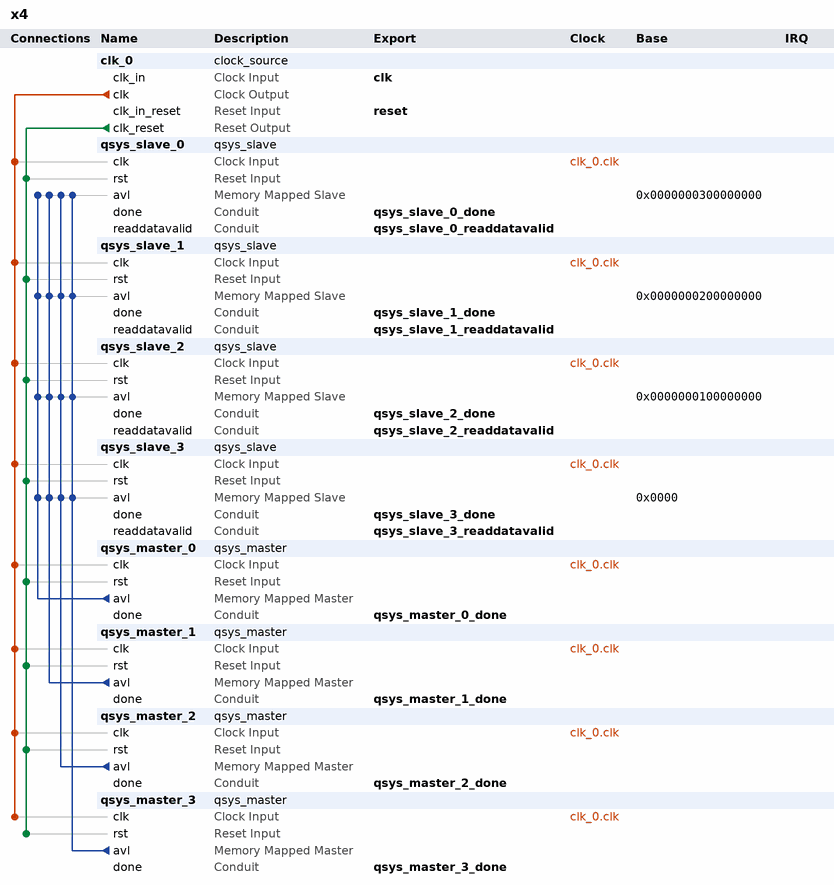
[diagram p0: system contents]
# Platform Designer (Qsys) system x4, Stratix V 5SGSED8K1F40C2
# Parameters at their usual value, and those the tool derives, are not listed.
package require -exact qsys 14.0
create_system x4
set_project_property DEVICE_FAMILY {Stratix V}
set_project_property DEVICE 5SGSED8K1F40C2

add_instance clk_0 clock_source 14.0
set_instance_parameter_value clk_0 clockFrequency 100000000

add_instance qsys_slave_0 qsys_slave 1.0
set_instance_parameter_value qsys_slave_0 WIDTH 32
set_instance_parameter_value qsys_slave_0 SRC_ID 0
set_instance_parameter_value qsys_slave_0 SNK_ID 1
set_instance_parameter_value qsys_slave_0 ADDR_WIDTH 30

add_instance qsys_slave_1 qsys_slave 1.0
set_instance_parameter_value qsys_slave_1 WIDTH 32
set_instance_parameter_value qsys_slave_1 SRC_ID 10
set_instance_parameter_value qsys_slave_1 SNK_ID 11
set_instance_parameter_value qsys_slave_1 ADDR_WIDTH 30

add_instance qsys_slave_2 qsys_slave 1.0
set_instance_parameter_value qsys_slave_2 WIDTH 32
set_instance_parameter_value qsys_slave_2 SRC_ID 12
set_instance_parameter_value qsys_slave_2 SNK_ID 13
set_instance_parameter_value qsys_slave_2 ADDR_WIDTH 30

add_instance qsys_slave_3 qsys_slave 1.0
set_instance_parameter_value qsys_slave_3 WIDTH 32
set_instance_parameter_value qsys_slave_3 SRC_ID 14
set_instance_parameter_value qsys_slave_3 SNK_ID 15
set_instance_parameter_value qsys_slave_3 ADDR_WIDTH 30

add_instance qsys_master_0 qsys_master 1.0
set_instance_parameter_value qsys_master_0 WIDTH 32
set_instance_parameter_value qsys_master_0 SRC_ID 2
set_instance_parameter_value qsys_master_0 SNK_ID 3
set_instance_parameter_value qsys_master_0 DST_ID 0
set_instance_parameter_value qsys_master_0 NUM_SLAVES 4
set_instance_parameter_value qsys_master_0 ADDR_WIDTH 34

add_instance qsys_master_1 qsys_master 1.0
set_instance_parameter_value qsys_master_1 WIDTH 32
set_instance_parameter_value qsys_master_1 SRC_ID 4
set_instance_parameter_value qsys_master_1 SNK_ID 5
set_instance_parameter_value qsys_master_1 DST_ID 0
set_instance_parameter_value qsys_master_1 NUM_SLAVES 4
set_instance_parameter_value qsys_master_1 ADDR_WIDTH 34

add_instance qsys_master_2 qsys_master 1.0
set_instance_parameter_value qsys_master_2 WIDTH 32
set_instance_parameter_value qsys_master_2 SRC_ID 6
set_instance_parameter_value qsys_master_2 SNK_ID 7
set_instance_parameter_value qsys_master_2 DST_ID 0
set_instance_parameter_value qsys_master_2 NUM_SLAVES 4
set_instance_parameter_value qsys_master_2 ADDR_WIDTH 34

add_instance qsys_master_3 qsys_master 1.0
set_instance_parameter_value qsys_master_3 WIDTH 32
set_instance_parameter_value qsys_master_3 SRC_ID 8
set_instance_parameter_value qsys_master_3 SNK_ID 9
set_instance_parameter_value qsys_master_3 DST_ID 0
set_instance_parameter_value qsys_master_3 NUM_SLAVES 4
set_instance_parameter_value qsys_master_3 ADDR_WIDTH 34

# connections
add_connection clk_0.clk qsys_master_0.clk clock
add_connection clk_0.clk qsys_master_1.clk clock
add_connection clk_0.clk qsys_master_2.clk clock
add_connection clk_0.clk qsys_master_3.clk clock
add_connection clk_0.clk qsys_slave_0.clk clock
add_connection clk_0.clk qsys_slave_1.clk clock
add_connection clk_0.clk qsys_slave_2.clk clock
add_connection clk_0.clk qsys_slave_3.clk clock
add_connection clk_0.clk_reset qsys_master_0.rst reset
add_connection clk_0.clk_reset qsys_master_1.rst reset
add_connection clk_0.clk_reset qsys_master_2.rst reset
add_connection clk_0.clk_reset qsys_master_3.rst reset
add_connection clk_0.clk_reset qsys_slave_0.rst reset
add_connection clk_0.clk_reset qsys_slave_1.rst reset
add_connection clk_0.clk_reset qsys_slave_2.rst reset
add_connection clk_0.clk_reset qsys_slave_3.rst reset
add_connection qsys_master_0.avl qsys_slave_0.avl avalon
set_connection_parameter_value qsys_master_0.avl/qsys_slave_0.avl baseAddress 0x0000000300000000
add_connection qsys_master_0.avl qsys_slave_1.avl avalon
set_connection_parameter_value qsys_master_0.avl/qsys_slave_1.avl baseAddress 0x0000000200000000
add_connection qsys_master_0.avl qsys_slave_2.avl avalon
set_connection_parameter_value qsys_master_0.avl/qsys_slave_2.avl baseAddress 0x0000000100000000
add_connection qsys_master_0.avl qsys_slave_3.avl avalon
set_connection_parameter_value qsys_master_0.avl/qsys_slave_3.avl baseAddress 0x0000
add_connection qsys_master_1.avl qsys_slave_0.avl avalon
set_connection_parameter_value qsys_master_1.avl/qsys_slave_0.avl baseAddress 0x0000000300000000
add_connection qsys_master_1.avl qsys_slave_1.avl avalon
set_connection_parameter_value qsys_master_1.avl/qsys_slave_1.avl baseAddress 0x0000000200000000
add_connection qsys_master_1.avl qsys_slave_2.avl avalon
set_connection_parameter_value qsys_master_1.avl/qsys_slave_2.avl baseAddress 0x0000000100000000
add_connection qsys_master_1.avl qsys_slave_3.avl avalon
set_connection_parameter_value qsys_master_1.avl/qsys_slave_3.avl baseAddress 0x0000
add_connection qsys_master_2.avl qsys_slave_0.avl avalon
set_connection_parameter_value qsys_master_2.avl/qsys_slave_0.avl baseAddress 0x0000000300000000
add_connection qsys_master_2.avl qsys_slave_1.avl avalon
set_connection_parameter_value qsys_master_2.avl/qsys_slave_1.avl baseAddress 0x0000000200000000
add_connection qsys_master_2.avl qsys_slave_2.avl avalon
set_connection_parameter_value qsys_master_2.avl/qsys_slave_2.avl baseAddress 0x0000000100000000
add_connection qsys_master_2.avl qsys_slave_3.avl avalon
set_connection_parameter_value qsys_master_2.avl/qsys_slave_3.avl baseAddress 0x0000
add_connection qsys_master_3.avl qsys_slave_0.avl avalon
set_connection_parameter_value qsys_master_3.avl/qsys_slave_0.avl baseAddress 0x0000000300000000
add_connection qsys_master_3.avl qsys_slave_1.avl avalon
set_connection_parameter_value qsys_master_3.avl/qsys_slave_1.avl baseAddress 0x0000000200000000
add_connection qsys_master_3.avl qsys_slave_2.avl avalon
set_connection_parameter_value qsys_master_3.avl/qsys_slave_2.avl baseAddress 0x0000000100000000
add_connection qsys_master_3.avl qsys_slave_3.avl avalon
set_connection_parameter_value qsys_master_3.avl/qsys_slave_3.avl baseAddress 0x0000

# exported interfaces
add_interface clk clock sink
set_interface_property clk EXPORT_OF clk_0.clk_in
add_interface reset reset sink
set_interface_property reset EXPORT_OF clk_0.clk_in_reset
add_interface qsys_slave_0_done conduit end
set_interface_property qsys_slave_0_done EXPORT_OF qsys_slave_0.done
add_interface qsys_slave_0_readdatavalid conduit end
set_interface_property qsys_slave_0_readdatavalid EXPORT_OF qsys_slave_0.readdatavalid
add_interface qsys_master_0_done conduit end
set_interface_property qsys_master_0_done EXPORT_OF qsys_master_0.done
add_interface qsys_master_1_done conduit end
set_interface_property qsys_master_1_done EXPORT_OF qsys_master_1.done
add_interface qsys_master_2_done conduit end
set_interface_property qsys_master_2_done EXPORT_OF qsys_master_2.done
add_interface qsys_master_3_done conduit end
set_interface_property qsys_master_3_done EXPORT_OF qsys_master_3.done
add_interface qsys_slave_1_done conduit end
set_interface_property qsys_slave_1_done EXPORT_OF qsys_slave_1.done
add_interface qsys_slave_1_readdatavalid conduit end
set_interface_property qsys_slave_1_readdatavalid EXPORT_OF qsys_slave_1.readdatavalid
add_interface qsys_slave_2_done conduit end
set_interface_property qsys_slave_2_done EXPORT_OF qsys_slave_2.done
add_interface qsys_slave_2_readdatavalid conduit end
set_interface_property qsys_slave_2_readdatavalid EXPORT_OF qsys_slave_2.readdatavalid
add_interface qsys_slave_3_done conduit end
set_interface_property qsys_slave_3_done EXPORT_OF qsys_slave_3.done
add_interface qsys_slave_3_readdatavalid conduit end
set_interface_property qsys_slave_3_readdatavalid EXPORT_OF qsys_slave_3.readdatavalid

set_interconnect_requirement {$system} qsys_mm.clockCrossingAdapter HANDSHAKE
set_interconnect_requirement {$system} qsys_mm.maxAdditionalLatency 4
set_interconnect_requirement {$system} qsys_mm.insertDefaultSlave FALSE

save_system x4.qsys
